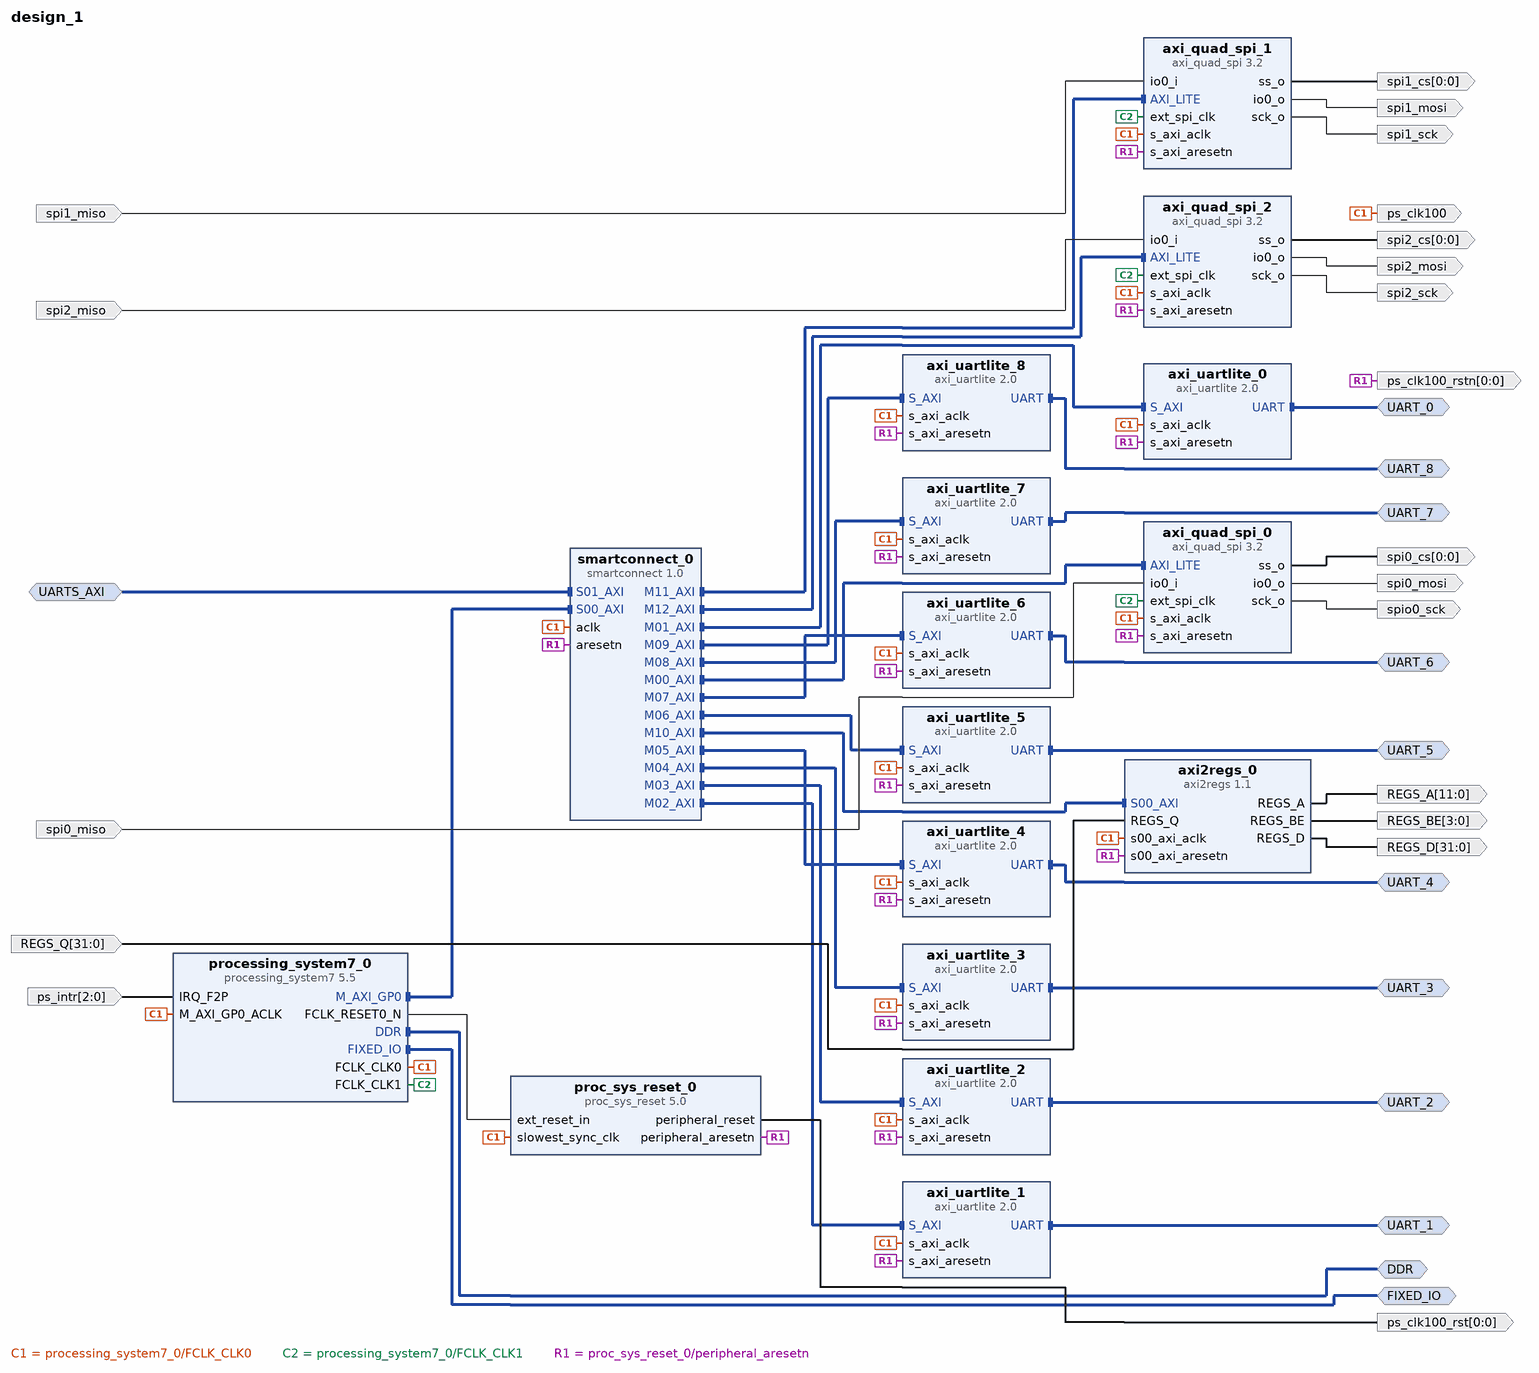
[diagram p0: block diagram of the top level]
# Vivado block design design_1, xc7z020clg400-1, Vivado 2023.2
create_bd_design design_1

create_bd_intf_port -mode Master -vlnv xilinx.com:interface:ddrx_rtl:1.0 DDR
create_bd_intf_port -mode Master -vlnv xilinx.com:display_processing_system7:fixedio_rtl:1.0 FIXED_IO
create_bd_intf_port -mode Master -vlnv xilinx.com:interface:uart_rtl:1.0 UART_0
create_bd_intf_port -mode Master -vlnv xilinx.com:interface:uart_rtl:1.0 UART_1
create_bd_intf_port -mode Master -vlnv xilinx.com:interface:uart_rtl:1.0 UART_2
create_bd_intf_port -mode Master -vlnv xilinx.com:interface:uart_rtl:1.0 UART_3
create_bd_intf_port -mode Master -vlnv xilinx.com:interface:uart_rtl:1.0 UART_4
create_bd_intf_port -mode Master -vlnv xilinx.com:interface:uart_rtl:1.0 UART_5
create_bd_intf_port -mode Master -vlnv xilinx.com:interface:uart_rtl:1.0 UART_6
create_bd_intf_port -mode Master -vlnv xilinx.com:interface:uart_rtl:1.0 UART_7
create_bd_intf_port -mode Master -vlnv xilinx.com:interface:uart_rtl:1.0 UART_8
create_bd_intf_port -mode Slave -vlnv xilinx.com:interface:aximm_rtl:1.0 UARTS_AXI
set_property -dict [list \
  CONFIG.ADDR_WIDTH 32 \
  CONFIG.ARUSER_WIDTH 0 \
  CONFIG.AWUSER_WIDTH 0 \
  CONFIG.BUSER_WIDTH 0 \
  CONFIG.DATA_WIDTH 32 \
  CONFIG.HAS_BRESP 1 \
  CONFIG.HAS_BURST 1 \
  CONFIG.HAS_CACHE 1 \
  CONFIG.HAS_LOCK 1 \
  CONFIG.HAS_PROT 1 \
  CONFIG.HAS_QOS 1 \
  CONFIG.HAS_REGION 1 \
  CONFIG.HAS_RRESP 1 \
  CONFIG.HAS_WSTRB 1 \
  CONFIG.ID_WIDTH 0 \
  CONFIG.MAX_BURST_LENGTH 256 \
  CONFIG.NUM_READ_OUTSTANDING 1 \
  CONFIG.NUM_READ_THREADS 1 \
  CONFIG.NUM_WRITE_OUTSTANDING 1 \
  CONFIG.NUM_WRITE_THREADS 1 \
  CONFIG.PROTOCOL AXI4 \
  CONFIG.READ_WRITE_MODE READ_WRITE \
  CONFIG.RUSER_BITS_PER_BYTE 0 \
  CONFIG.RUSER_WIDTH 0 \
  CONFIG.SUPPORTS_NARROW_BURST 1 \
  CONFIG.WUSER_BITS_PER_BYTE 0 \
  CONFIG.WUSER_WIDTH 0 \
  CONFIG.master_id 2 \
] [get_bd_intf_ports UARTS_AXI]
create_bd_port -dir O -type clk ps_clk100
set_property -dict {CONFIG.ASSOCIATED_BUSIF UARTS_AXI} [get_bd_ports ps_clk100]
create_bd_port -dir O -from 0 -to 0 -type rst ps_clk100_rstn
create_bd_port -dir O -from 0 -to 0 -type rst ps_clk100_rst
create_bd_port -dir O spio0_sck
create_bd_port -dir O -from 0 -to 0 spi0_cs
create_bd_port -dir I spi0_miso
create_bd_port -dir O spi0_mosi
create_bd_port -dir I spi2_miso
create_bd_port -dir O spi2_mosi
create_bd_port -dir O spi2_sck
create_bd_port -dir O -from 0 -to 0 spi2_cs
create_bd_port -dir I spi1_miso
create_bd_port -dir O spi1_mosi
create_bd_port -dir O spi1_sck
create_bd_port -dir O -from 0 -to 0 spi1_cs
create_bd_port -dir O -from 3 -to 0 REGS_BE
create_bd_port -dir O -from 31 -to 0 REGS_D
create_bd_port -dir O -from 11 -to 0 REGS_A
create_bd_port -dir I -from 31 -to 0 REGS_Q
create_bd_port -dir I -from 2 -to 0 -type intr ps_intr
set_property -dict {CONFIG.PortWidth 3} [get_bd_ports ps_intr]

create_bd_cell -type ip -vlnv xilinx.com:ip:processing_system7:5.5 processing_system7_0
set_property -dict [list \
  CONFIG.PCW_APU_PERIPHERAL_FREQMHZ 667 \
  CONFIG.PCW_ENET0_ENET0_IO {MIO 16 .. 27} \
  CONFIG.PCW_ENET0_GRP_MDIO_ENABLE 1 \
  CONFIG.PCW_ENET0_GRP_MDIO_IO {MIO 52 .. 53} \
  CONFIG.PCW_ENET0_PERIPHERAL_ENABLE 1 \
  CONFIG.PCW_ENET0_RESET_ENABLE 0 \
  CONFIG.PCW_ENET_RESET_ENABLE 1 \
  CONFIG.PCW_ENET_RESET_SELECT {Share reset pin} \
  CONFIG.PCW_EN_CLK1_PORT 1 \
  CONFIG.PCW_FCLK_CLK1_BUF TRUE \
  CONFIG.PCW_FPGA0_PERIPHERAL_FREQMHZ 100 \
  CONFIG.PCW_FPGA1_PERIPHERAL_FREQMHZ 25 \
  CONFIG.PCW_FPGA2_PERIPHERAL_FREQMHZ 33.333333 \
  CONFIG.PCW_FPGA_FCLK1_ENABLE 1 \
  CONFIG.PCW_GPIO_MIO_GPIO_ENABLE 1 \
  CONFIG.PCW_GPIO_MIO_GPIO_IO MIO \
  CONFIG.PCW_GPIO_PERIPHERAL_ENABLE 1 \
  CONFIG.PCW_I2C_RESET_ENABLE 0 \
  CONFIG.PCW_IRQ_F2P_INTR 1 \
  CONFIG.PCW_PERIPHERAL_BOARD_PRESET part0 \
  CONFIG.PCW_PRESET_BANK1_VOLTAGE {LVCMOS 1.8V} \
  CONFIG.PCW_QSPI_GRP_FBCLK_ENABLE 1 \
  CONFIG.PCW_QSPI_GRP_FBCLK_IO {MIO 8} \
  CONFIG.PCW_QSPI_GRP_SINGLE_SS_ENABLE 1 \
  CONFIG.PCW_QSPI_GRP_SINGLE_SS_IO {MIO 1 .. 6} \
  CONFIG.PCW_QSPI_PERIPHERAL_ENABLE 1 \
  CONFIG.PCW_QSPI_QSPI_IO {MIO 1 .. 6} \
  CONFIG.PCW_SD0_GRP_CD_ENABLE 0 \
  CONFIG.PCW_SD0_GRP_WP_ENABLE 0 \
  CONFIG.PCW_SD0_PERIPHERAL_ENABLE 1 \
  CONFIG.PCW_SD0_SD0_IO {MIO 40 .. 45} \
  CONFIG.PCW_SDIO_PERIPHERAL_FREQMHZ 25 \
  CONFIG.PCW_SINGLE_QSPI_DATA_MODE x4 \
  CONFIG.PCW_SPI0_PERIPHERAL_ENABLE 1 \
  CONFIG.PCW_SPI0_SPI0_IO {MIO 28 .. 33} \
  CONFIG.PCW_UART1_PERIPHERAL_ENABLE 1 \
  CONFIG.PCW_UART1_UART1_IO {MIO 48 .. 49} \
  CONFIG.PCW_UART_PERIPHERAL_FREQMHZ 50 \
  CONFIG.PCW_UIPARAM_DDR_FREQ_MHZ 533.333333 \
  CONFIG.PCW_UIPARAM_DDR_PARTNO {MT41K256M16 RE-125} \
  CONFIG.PCW_USB0_PERIPHERAL_ENABLE 0 \
  CONFIG.PCW_USB_RESET_ENABLE 0 \
  CONFIG.PCW_USE_FABRIC_INTERRUPT 1 \
] [get_bd_cells processing_system7_0]
# 508 more settings of processing_system7_0 are not shown: defaults, MIO pin electricals, DDR timing, and values the tool derives
create_bd_cell -type ip -vlnv xilinx.com:ip:smartconnect:1.0 smartconnect_0
set_property -dict {CONFIG.NUM_MI 13 CONFIG.NUM_SI 2} [get_bd_cells smartconnect_0]
create_bd_cell -type ip -vlnv xilinx.com:ip:axi_quad_spi:3.2 axi_quad_spi_0
set_property -dict {CONFIG.C_NUM_SS_BITS 1 CONFIG.C_SPI_MODE 0 CONFIG.C_USE_STARTUP 0} [get_bd_cells axi_quad_spi_0]
create_bd_cell -type ip -vlnv xilinx.com:ip:axi_uartlite:2.0 axi_uartlite_0
set_property -dict {CONFIG.C_BAUDRATE 115200} [get_bd_cells axi_uartlite_0]
create_bd_cell -type ip -vlnv xilinx.com:ip:axi_uartlite:2.0 axi_uartlite_1
set_property -dict {CONFIG.C_BAUDRATE 115200} [get_bd_cells axi_uartlite_1]
create_bd_cell -type ip -vlnv xilinx.com:ip:axi_uartlite:2.0 axi_uartlite_2
set_property -dict {CONFIG.C_BAUDRATE 115200} [get_bd_cells axi_uartlite_2]
create_bd_cell -type ip -vlnv xilinx.com:ip:axi_uartlite:2.0 axi_uartlite_3
set_property -dict {CONFIG.C_BAUDRATE 115200} [get_bd_cells axi_uartlite_3]
create_bd_cell -type ip -vlnv xilinx.com:ip:axi_uartlite:2.0 axi_uartlite_4
set_property -dict {CONFIG.C_BAUDRATE 115200} [get_bd_cells axi_uartlite_4]
create_bd_cell -type ip -vlnv xilinx.com:ip:axi_uartlite:2.0 axi_uartlite_5
set_property -dict {CONFIG.C_BAUDRATE 115200} [get_bd_cells axi_uartlite_5]
create_bd_cell -type ip -vlnv xilinx.com:ip:axi_uartlite:2.0 axi_uartlite_6
set_property -dict {CONFIG.C_BAUDRATE 115200} [get_bd_cells axi_uartlite_6]
create_bd_cell -type ip -vlnv xilinx.com:ip:axi_uartlite:2.0 axi_uartlite_7
set_property -dict {CONFIG.C_BAUDRATE 115200} [get_bd_cells axi_uartlite_7]
create_bd_cell -type ip -vlnv xilinx.com:ip:axi_uartlite:2.0 axi_uartlite_8
set_property -dict {CONFIG.C_BAUDRATE 115200} [get_bd_cells axi_uartlite_8]
create_bd_cell -type ip -vlnv xilinx.com:ip:proc_sys_reset:5.0 proc_sys_reset_0
create_bd_cell -type ip -vlnv xilinx.com:ip:axi_quad_spi:3.2 axi_quad_spi_1
set_property -dict {CONFIG.C_NUM_SS_BITS 1 CONFIG.C_SPI_MODE 0 CONFIG.C_USE_STARTUP 0} [get_bd_cells axi_quad_spi_1]
create_bd_cell -type ip -vlnv xilinx.com:ip:axi_quad_spi:3.2 axi_quad_spi_2
set_property -dict {CONFIG.C_NUM_SS_BITS 1 CONFIG.C_SPI_MODE 0 CONFIG.C_USE_STARTUP 0} [get_bd_cells axi_quad_spi_2]
create_bd_cell -type ip -vlnv bsplinux.net:user:axi2regs:1.1 axi2regs_0

# ---- connections ----

connect_bd_intf_net -intf_net S01_AXI_0_1 [get_bd_intf_ports UARTS_AXI] [get_bd_intf_pins smartconnect_0/S01_AXI]
connect_bd_intf_net [get_bd_intf_ports UART_0] [get_bd_intf_pins axi_uartlite_0/UART]
connect_bd_intf_net [get_bd_intf_ports UART_1] [get_bd_intf_pins axi_uartlite_1/UART]
connect_bd_intf_net [get_bd_intf_ports UART_2] [get_bd_intf_pins axi_uartlite_2/UART]
connect_bd_intf_net [get_bd_intf_ports UART_3] [get_bd_intf_pins axi_uartlite_3/UART]
connect_bd_intf_net [get_bd_intf_ports UART_4] [get_bd_intf_pins axi_uartlite_4/UART]
connect_bd_intf_net [get_bd_intf_ports UART_5] [get_bd_intf_pins axi_uartlite_5/UART]
connect_bd_intf_net [get_bd_intf_ports UART_6] [get_bd_intf_pins axi_uartlite_6/UART]
connect_bd_intf_net [get_bd_intf_ports UART_7] [get_bd_intf_pins axi_uartlite_7/UART]
connect_bd_intf_net [get_bd_intf_ports UART_8] [get_bd_intf_pins axi_uartlite_8/UART]
connect_bd_intf_net [get_bd_intf_ports DDR] [get_bd_intf_pins processing_system7_0/DDR]
connect_bd_intf_net [get_bd_intf_ports FIXED_IO] [get_bd_intf_pins processing_system7_0/FIXED_IO]
connect_bd_intf_net [get_bd_intf_pins processing_system7_0/M_AXI_GP0] [get_bd_intf_pins smartconnect_0/S00_AXI]
connect_bd_intf_net [get_bd_intf_pins axi_quad_spi_0/AXI_LITE] [get_bd_intf_pins smartconnect_0/M00_AXI]
connect_bd_intf_net [get_bd_intf_pins smartconnect_0/M01_AXI] [get_bd_intf_pins axi_uartlite_0/S_AXI]
connect_bd_intf_net [get_bd_intf_pins smartconnect_0/M02_AXI] [get_bd_intf_pins axi_uartlite_1/S_AXI]
connect_bd_intf_net [get_bd_intf_pins smartconnect_0/M03_AXI] [get_bd_intf_pins axi_uartlite_2/S_AXI]
connect_bd_intf_net [get_bd_intf_pins smartconnect_0/M04_AXI] [get_bd_intf_pins axi_uartlite_3/S_AXI]
connect_bd_intf_net [get_bd_intf_pins smartconnect_0/M05_AXI] [get_bd_intf_pins axi_uartlite_4/S_AXI]
connect_bd_intf_net [get_bd_intf_pins smartconnect_0/M06_AXI] [get_bd_intf_pins axi_uartlite_5/S_AXI]
connect_bd_intf_net [get_bd_intf_pins smartconnect_0/M07_AXI] [get_bd_intf_pins axi_uartlite_6/S_AXI]
connect_bd_intf_net [get_bd_intf_pins smartconnect_0/M08_AXI] [get_bd_intf_pins axi_uartlite_7/S_AXI]
connect_bd_intf_net [get_bd_intf_pins smartconnect_0/M09_AXI] [get_bd_intf_pins axi_uartlite_8/S_AXI]
connect_bd_intf_net [get_bd_intf_pins smartconnect_0/M10_AXI] [get_bd_intf_pins axi2regs_0/S00_AXI]
connect_bd_intf_net [get_bd_intf_pins axi_quad_spi_1/AXI_LITE] [get_bd_intf_pins smartconnect_0/M11_AXI]
connect_bd_intf_net [get_bd_intf_pins axi_quad_spi_2/AXI_LITE] [get_bd_intf_pins smartconnect_0/M12_AXI]
connect_bd_net -net IRQ_F2P_0_1 [get_bd_ports ps_intr] [get_bd_pins processing_system7_0/IRQ_F2P]
connect_bd_net -net REGS_Q_0_1 [get_bd_ports REGS_Q] [get_bd_pins axi2regs_0/REGS_Q]
connect_bd_net [get_bd_pins axi2regs_0/REGS_A] [get_bd_ports REGS_A]
connect_bd_net [get_bd_pins axi2regs_0/REGS_BE] [get_bd_ports REGS_BE]
connect_bd_net [get_bd_pins axi2regs_0/REGS_D] [get_bd_ports REGS_D]
connect_bd_net [get_bd_pins axi_quad_spi_0/io0_o] [get_bd_ports spi0_mosi]
connect_bd_net [get_bd_pins axi_quad_spi_0/sck_o] [get_bd_ports spio0_sck]
connect_bd_net [get_bd_pins axi_quad_spi_0/ss_o] [get_bd_ports spi0_cs]
connect_bd_net [get_bd_pins axi_quad_spi_1/io0_o] [get_bd_ports spi1_mosi]
connect_bd_net [get_bd_pins axi_quad_spi_1/sck_o] [get_bd_ports spi1_sck]
connect_bd_net [get_bd_pins axi_quad_spi_1/ss_o] [get_bd_ports spi1_cs]
connect_bd_net [get_bd_pins axi_quad_spi_2/io0_o] [get_bd_ports spi2_mosi]
connect_bd_net [get_bd_pins axi_quad_spi_2/sck_o] [get_bd_ports spi2_sck]
connect_bd_net [get_bd_pins axi_quad_spi_2/ss_o] [get_bd_ports spi2_cs]
connect_bd_net -net io0_i_0_1 [get_bd_ports spi0_miso] [get_bd_pins axi_quad_spi_0/io0_i]
connect_bd_net -net io0_i_0_2 [get_bd_ports spi2_miso] [get_bd_pins axi_quad_spi_2/io0_i]
connect_bd_net -net io0_i_0_3 [get_bd_ports spi1_miso] [get_bd_pins axi_quad_spi_1/io0_i]
connect_bd_net [get_bd_pins proc_sys_reset_0/peripheral_reset] [get_bd_ports ps_clk100_rst]
connect_bd_net [get_bd_pins processing_system7_0/FCLK_CLK0] \
  [get_bd_ports ps_clk100] [get_bd_pins axi2regs_0/s00_axi_aclk] [get_bd_pins axi_quad_spi_0/s_axi_aclk] \
  [get_bd_pins axi_quad_spi_1/s_axi_aclk] [get_bd_pins axi_quad_spi_2/s_axi_aclk] [get_bd_pins axi_uartlite_0/s_axi_aclk] \
  [get_bd_pins axi_uartlite_1/s_axi_aclk] [get_bd_pins axi_uartlite_2/s_axi_aclk] [get_bd_pins axi_uartlite_3/s_axi_aclk] \
  [get_bd_pins axi_uartlite_4/s_axi_aclk] [get_bd_pins axi_uartlite_5/s_axi_aclk] [get_bd_pins axi_uartlite_6/s_axi_aclk] \
  [get_bd_pins axi_uartlite_7/s_axi_aclk] [get_bd_pins axi_uartlite_8/s_axi_aclk] \
  [get_bd_pins proc_sys_reset_0/slowest_sync_clk] [get_bd_pins processing_system7_0/M_AXI_GP0_ACLK] \
  [get_bd_pins smartconnect_0/aclk]
connect_bd_net [get_bd_pins processing_system7_0/FCLK_CLK1] \
  [get_bd_pins axi_quad_spi_0/ext_spi_clk] [get_bd_pins axi_quad_spi_1/ext_spi_clk] [get_bd_pins axi_quad_spi_2/ext_spi_clk]
connect_bd_net -net processing_system7_0_FCLK_RESET0_N [get_bd_pins proc_sys_reset_0/peripheral_aresetn] \
  [get_bd_ports ps_clk100_rstn] [get_bd_pins axi2regs_0/s00_axi_aresetn] [get_bd_pins axi_quad_spi_0/s_axi_aresetn] \
  [get_bd_pins axi_quad_spi_1/s_axi_aresetn] [get_bd_pins axi_quad_spi_2/s_axi_aresetn] \
  [get_bd_pins axi_uartlite_0/s_axi_aresetn] [get_bd_pins axi_uartlite_1/s_axi_aresetn] \
  [get_bd_pins axi_uartlite_2/s_axi_aresetn] [get_bd_pins axi_uartlite_3/s_axi_aresetn] \
  [get_bd_pins axi_uartlite_4/s_axi_aresetn] [get_bd_pins axi_uartlite_5/s_axi_aresetn] \
  [get_bd_pins axi_uartlite_6/s_axi_aresetn] [get_bd_pins axi_uartlite_7/s_axi_aresetn] \
  [get_bd_pins axi_uartlite_8/s_axi_aresetn] [get_bd_pins smartconnect_0/aresetn]
connect_bd_net [get_bd_pins processing_system7_0/FCLK_RESET0_N] [get_bd_pins proc_sys_reset_0/ext_reset_in]

# ---- address map ----
assign_bd_address -offset 0x41E00000 -range 64K -target_address_space [get_bd_addr_spaces processing_system7_0/Data] [get_bd_addr_segs axi_quad_spi_0/AXI_LITE/Reg]
assign_bd_address -offset 0x41E10000 -range 64K -target_address_space [get_bd_addr_spaces processing_system7_0/Data] [get_bd_addr_segs axi_quad_spi_1/AXI_LITE/Reg]
assign_bd_address -offset 0x41E20000 -range 64K -target_address_space [get_bd_addr_spaces processing_system7_0/Data] [get_bd_addr_segs axi_quad_spi_2/AXI_LITE/Reg]
assign_bd_address -offset 0x42C00000 -range 64K -target_address_space [get_bd_addr_spaces processing_system7_0/Data] [get_bd_addr_segs axi_uartlite_0/S_AXI/Reg]
assign_bd_address -offset 0x42C10000 -range 64K -target_address_space [get_bd_addr_spaces processing_system7_0/Data] [get_bd_addr_segs axi_uartlite_1/S_AXI/Reg]
assign_bd_address -offset 0x42C20000 -range 64K -target_address_space [get_bd_addr_spaces processing_system7_0/Data] [get_bd_addr_segs axi_uartlite_2/S_AXI/Reg]
assign_bd_address -offset 0x42C30000 -range 64K -target_address_space [get_bd_addr_spaces processing_system7_0/Data] [get_bd_addr_segs axi_uartlite_3/S_AXI/Reg]
assign_bd_address -offset 0x42C40000 -range 64K -target_address_space [get_bd_addr_spaces processing_system7_0/Data] [get_bd_addr_segs axi_uartlite_4/S_AXI/Reg]
assign_bd_address -offset 0x42C50000 -range 64K -target_address_space [get_bd_addr_spaces processing_system7_0/Data] [get_bd_addr_segs axi_uartlite_5/S_AXI/Reg]
assign_bd_address -offset 0x42C60000 -range 64K -target_address_space [get_bd_addr_spaces processing_system7_0/Data] [get_bd_addr_segs axi_uartlite_6/S_AXI/Reg]
assign_bd_address -offset 0x42C70000 -range 64K -target_address_space [get_bd_addr_spaces processing_system7_0/Data] [get_bd_addr_segs axi_uartlite_7/S_AXI/Reg]
assign_bd_address -offset 0x42C80000 -range 64K -target_address_space [get_bd_addr_spaces processing_system7_0/Data] [get_bd_addr_segs axi_uartlite_8/S_AXI/Reg]
assign_bd_address -offset 0x43C00000 -range 4K -target_address_space [get_bd_addr_spaces processing_system7_0/Data] [get_bd_addr_segs axi2regs_0/S00_AXI/S00_AXI_reg]
assign_bd_address -offset 0x42C00000 -range 64K -target_address_space [get_bd_addr_spaces UARTS_AXI] [get_bd_addr_segs axi_uartlite_0/S_AXI/Reg]
assign_bd_address -offset 0x42C10000 -range 64K -target_address_space [get_bd_addr_spaces UARTS_AXI] [get_bd_addr_segs axi_uartlite_1/S_AXI/Reg]
assign_bd_address -offset 0x42C20000 -range 64K -target_address_space [get_bd_addr_spaces UARTS_AXI] [get_bd_addr_segs axi_uartlite_2/S_AXI/Reg]
assign_bd_address -offset 0x42C30000 -range 64K -target_address_space [get_bd_addr_spaces UARTS_AXI] [get_bd_addr_segs axi_uartlite_3/S_AXI/Reg]
assign_bd_address -offset 0x42C40000 -range 64K -target_address_space [get_bd_addr_spaces UARTS_AXI] [get_bd_addr_segs axi_uartlite_4/S_AXI/Reg]
assign_bd_address -offset 0x42C50000 -range 64K -target_address_space [get_bd_addr_spaces UARTS_AXI] [get_bd_addr_segs axi_uartlite_5/S_AXI/Reg]
assign_bd_address -offset 0x42C60000 -range 64K -target_address_space [get_bd_addr_spaces UARTS_AXI] [get_bd_addr_segs axi_uartlite_6/S_AXI/Reg]
assign_bd_address -offset 0x42C70000 -range 64K -target_address_space [get_bd_addr_spaces UARTS_AXI] [get_bd_addr_segs axi_uartlite_7/S_AXI/Reg]
assign_bd_address -offset 0x42C80000 -range 64K -target_address_space [get_bd_addr_spaces UARTS_AXI] [get_bd_addr_segs axi_uartlite_8/S_AXI/Reg]
exclude_bd_addr_seg -offset 0x41E00000 -range 64K -target_address_space [get_bd_addr_spaces UARTS_AXI] [get_bd_addr_segs axi_quad_spi_0/AXI_LITE/Reg]
exclude_bd_addr_seg -offset 0x41E10000 -range 64K -target_address_space [get_bd_addr_spaces UARTS_AXI] [get_bd_addr_segs axi_quad_spi_1/AXI_LITE/Reg]
exclude_bd_addr_seg -offset 0x41E20000 -range 64K -target_address_space [get_bd_addr_spaces UARTS_AXI] [get_bd_addr_segs axi_quad_spi_2/AXI_LITE/Reg]
exclude_bd_addr_seg -offset 0x43C00000 -range 4K -target_address_space [get_bd_addr_spaces UARTS_AXI] [get_bd_addr_segs axi2regs_0/S00_AXI/S00_AXI_reg]

validate_bd_design
save_bd_design
